# Altium project SYNCBOX_V3I1.PrjPcb (part 5 of 5)

## Sheet [08] - CPU USB.SchDoc
size A2; Organization: Altium Limited; Address1: L3, 12a Rodborough Rd; Address2: Frenchs Forest; Address3: NSW; Address4: Australia 2086; DocumentNumber: 8; SheetNumber: 8; SheetTotal: 11
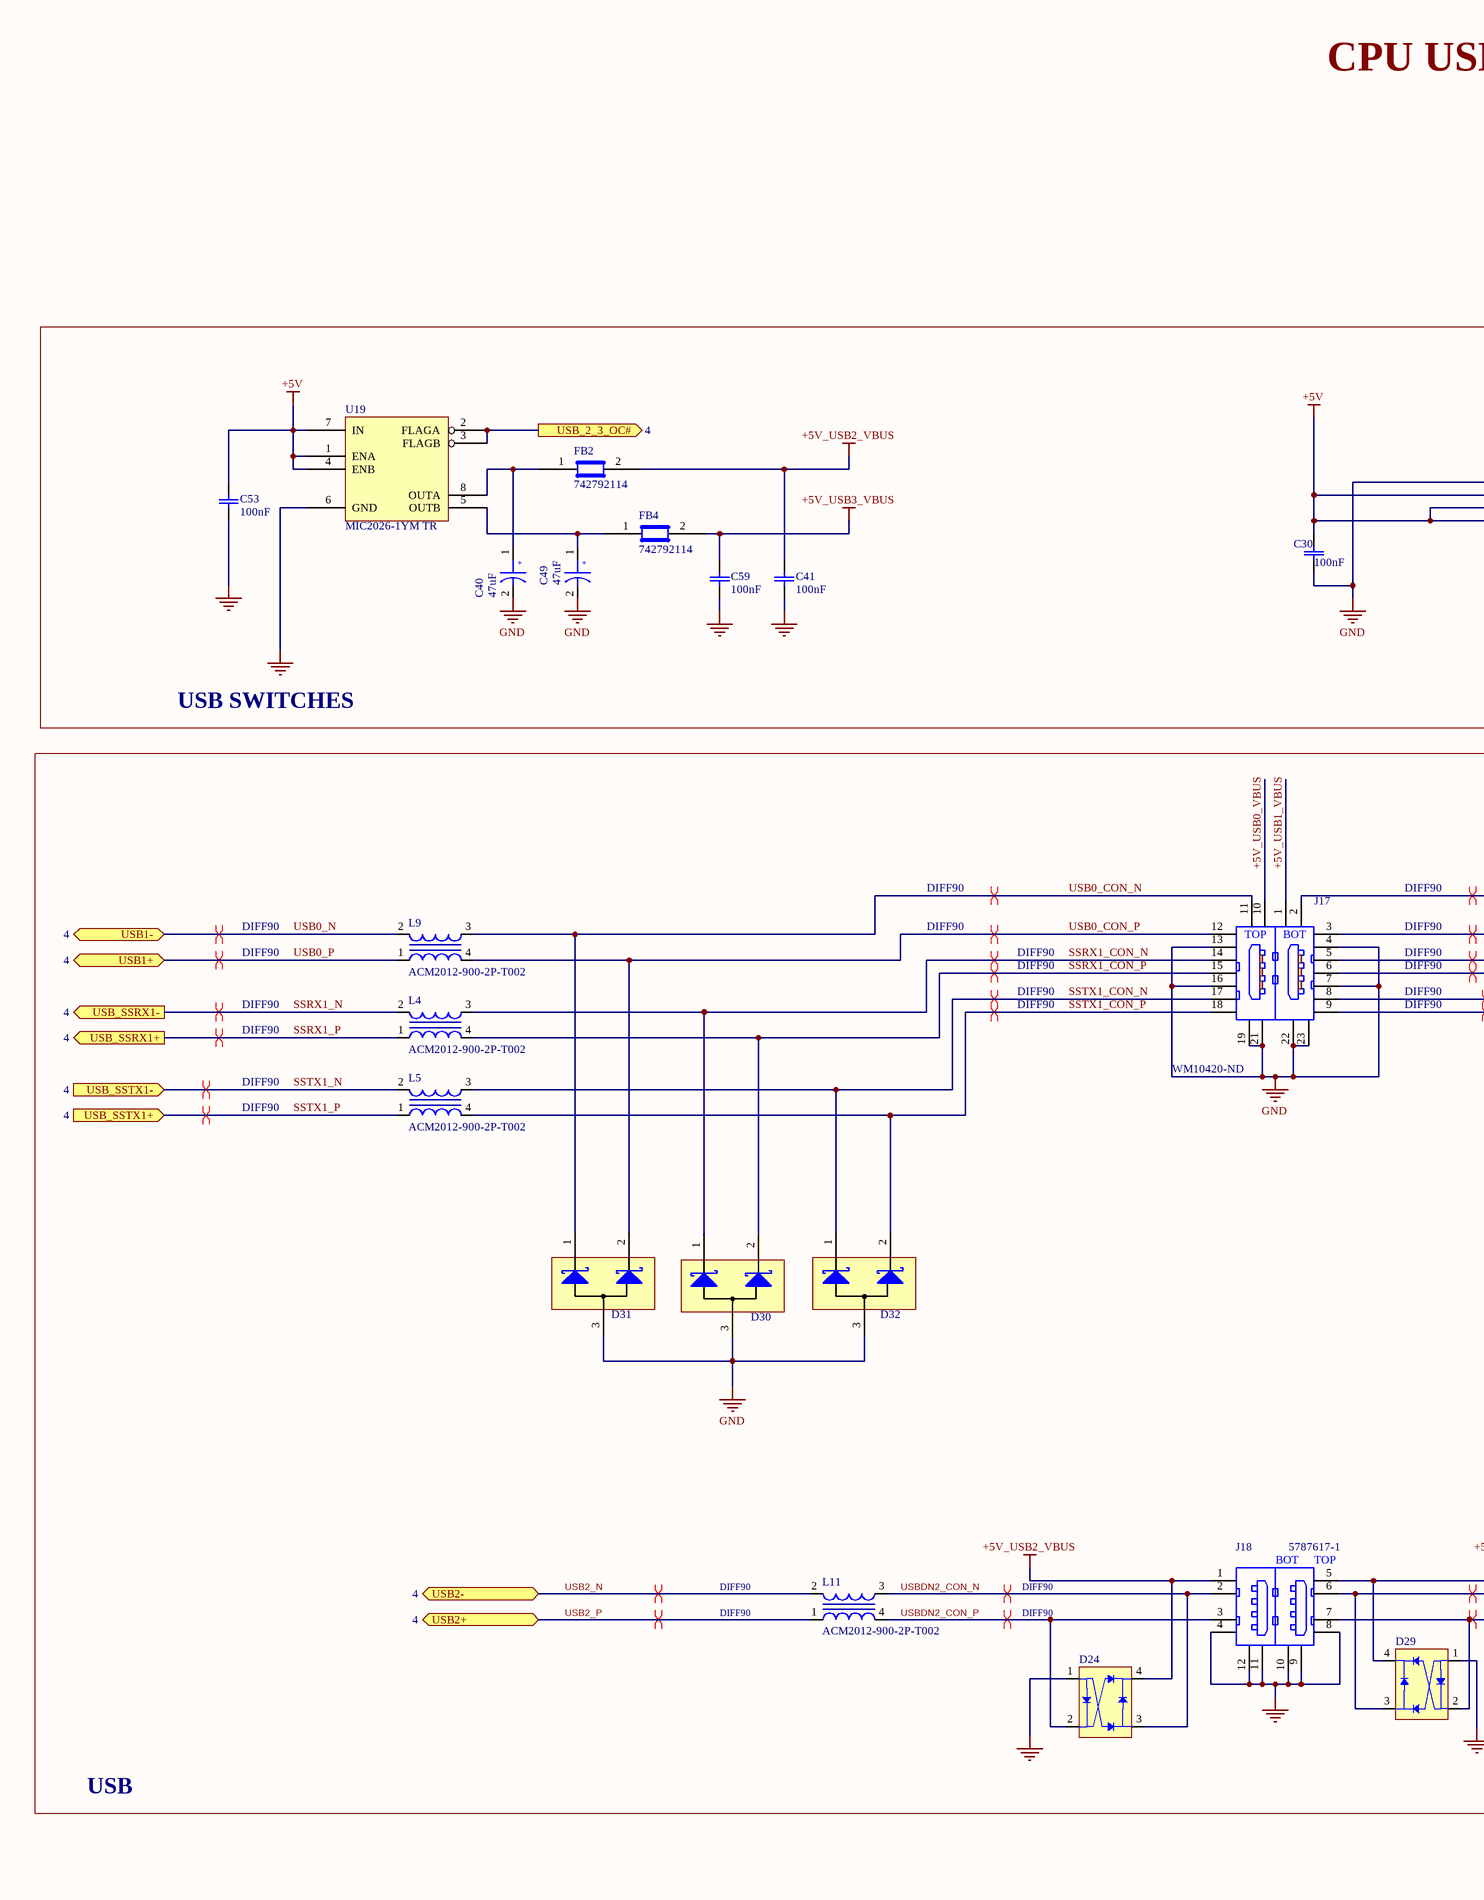
[diagram p12: [08] - CPU USB.SchDoc, left]
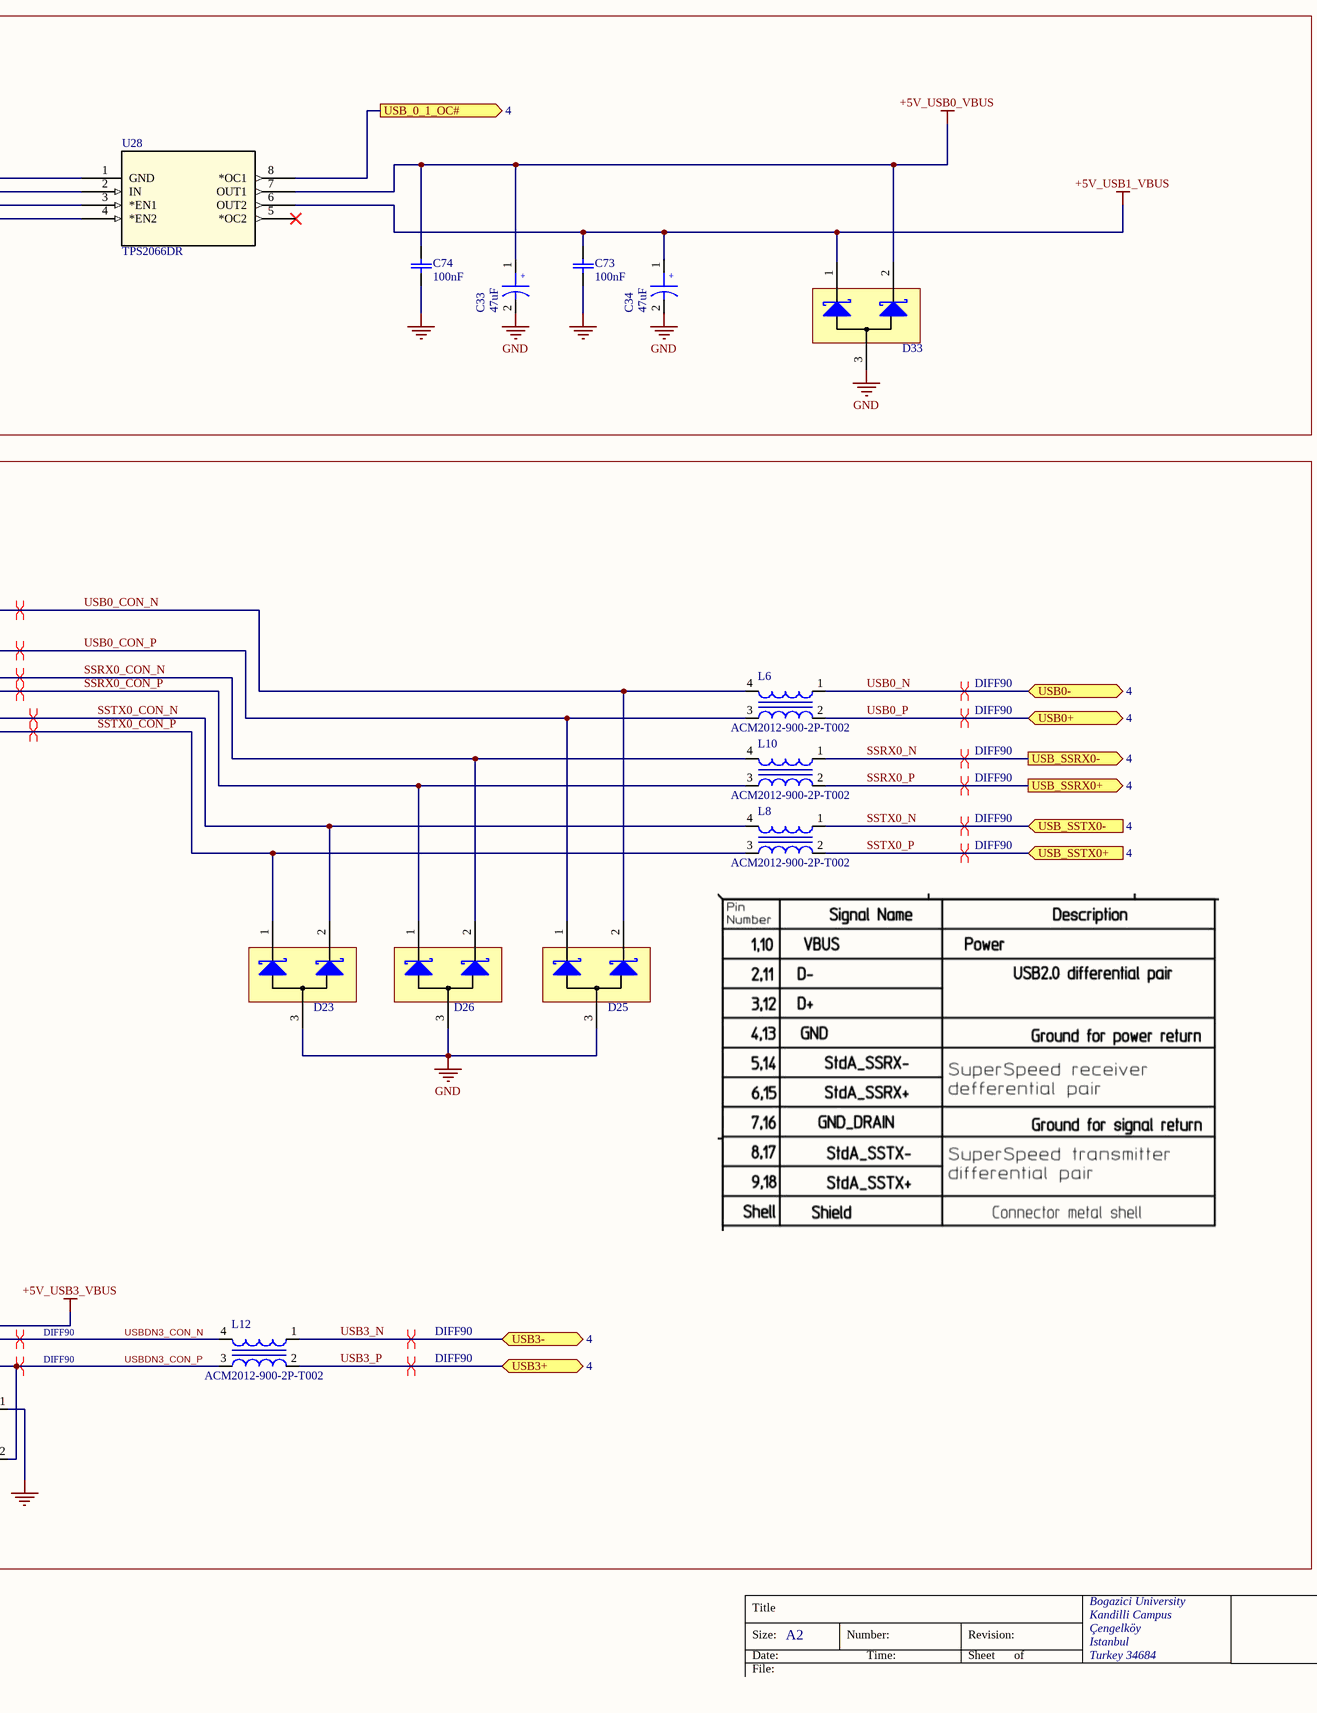
[diagram p13: [08] - CPU USB.SchDoc, right]

### Parts
C30  100nF  [C0402]
C33  47uF  [CAP_P-B]
C34  47uF  [CAP_P-B]
C40  47uF  [CAP_P-B]
C41  100nF  [C0402]
C49  47uF  [CAP_P-B]
C53  100nF  [C0402]
C59  100nF  [C0402]
C73  100nF  [C0402]
C74  100nF  [C0402]
D23  ESD5V3U2U03FH6327XTSA1  [PG-TSLP-3-7]  (value not drawn)
D24  BAS4002ARPPE6327HTSA1  [SOT143B]  (value not drawn)
D25  ESD5V3U2U03FH6327XTSA1  [PG-TSLP-3-7]  (value not drawn)
D26  ESD5V3U2U03FH6327XTSA1  [PG-TSLP-3-7]  (value not drawn)
D29  BAS4002ARPPE6327HTSA1  [SOT143B]  (value not drawn)
D30  ESD5V3U2U03FH6327XTSA1  [PG-TSLP-3-7]  (value not drawn)
D31  ESD5V3U2U03FH6327XTSA1  [PG-TSLP-3-7]  (value not drawn)
D32  ESD5V3U2U03FH6327XTSA1  [PG-TSLP-3-7]  (value not drawn)
D33  ESD5V3U2U03FH6327XTSA1  [PG-TSLP-3-7]  (value not drawn)
FB2  742792114  [Ferrite bead]
FB4  742792114  [Ferrite bead]
J17  WM10420-ND  [USB 3 STACK]
J18  5787617-1  [USB-2A]
L4  ACM2012-900-2P-T002  [ACM2012]
L5  ACM2012-900-2P-T002  [ACM2012]
L6  ACM2012-900-2P-T002  [ACM2012]
L8  ACM2012-900-2P-T002  [ACM2012]
L9  ACM2012-900-2P-T002  [ACM2012]
L10  ACM2012-900-2P-T002  [ACM2012]
L11  ACM2012-900-2P-T002  [ACM2012]
L12  ACM2012-900-2P-T002  [ACM2012]
U19  MIC2026-1YM TR  [8_SOIC_3.9MM]
U28  TPS2066DR  [D8]

### Blocks framed on the sheet
USB SWITCHES: C30 C33 C34 C40 C41 C49 C53 C59 C73 C74 D33 FB2 FB4 U19 U28
USB: D23-D26 D29-D32 J17 J18 L4-L6 L8-L12

### Ports
USB0+ (bidir, see 4), USB0- (bidir, see 4), USB1+ (bidir, see 4), USB1- (bidir, see 4), USB2+ (bidir, see 4), USB2- (bidir, see 4), USB3+ (bidir, see 4), USB3- (bidir, see 4), USB_0_1_OC# (out, see 4), USB_2_3_OC# (out, see 4), USB_SSRX0+ (out, see 4), USB_SSRX0- (out, see 4), USB_SSRX1+ (out, see 4), USB_SSRX1- (out, see 4), USB_SSTX0+ (in, see 4), USB_SSTX0- (in, see 4), USB_SSTX1+ (in, see 4), USB_SSTX1- (in, see 4)

### Nets
+5V: C30.2 C53.2 U19.1(ENA) U19.4(ENB) U19.7(IN) U28.2(IN) U28.3(*EN1) U28.4(*EN2)
+5V_USB0_VBUS: C33.1 C74.2 D33.2 J17.10(VBUS2) U28.7(OUT1)
+5V_USB1_VBUS: C34.1 C73.2 D33.1 J17.1(VBUS1) U28.6(OUT2)
+5V_USB2_VBUS: C41.2 D24.4 FB2.2 J18.1(VBUS)
+5V_USB3_VBUS: C59.2 D29.4 FB4.2 J18.5(VBUS2)
GND: C30.1 C33.2 C34.2 C40.2 C41.1 C49.2 C53.1 C59.1 C73.1 C74.1 D23.3 D24.1 D25.3 D26.3 D29.1 D30.3 D31.3 D32.3 D33.3 J17.4(GND) J17.7(GND_DRAIN1) J17.13(GND) J17.16(GND_DRAIN2) J17.19(SHIELD) J17.21(SHIELD) J17.22(SHIELD) J17.23(SHIELD) J18.4(GND) J18.8(GND) J18.9(SHIELD) J18.10(SHIELD) J18.11(SHIELD) J18.12(SHIELD) U19.6(GND) U28.1(GND)
SSRX0_CON_N: D26.2 J17.5(SSRX0-) L10.4
SSRX0_CON_P: D26.1 J17.6(SSRX0+) L10.3
SSRX0_N: L10.1 ; port USB_SSRX0-
SSRX0_P: L10.2 ; port USB_SSRX0+
SSRX1_CON_N: D30.1 J17.14(SSRX2-) L4.3
SSRX1_CON_P: D30.2 J17.15(SSRX2+) L4.4
SSRX1_N: L4.2 ; port USB_SSRX1-
SSRX1_P: L4.1 ; port USB_SSRX1+
SSTX0_CON_N: D23.2 J17.8(SSTX0-) L8.4
SSTX0_CON_P: D23.1 J17.9(SSTX0+) L8.3
SSTX0_N: L8.1 ; port USB_SSTX0-
SSTX0_P: L8.2 ; port USB_SSTX0+
SSTX1_CON_N: D32.1 J17.17(SSTX2-) L5.3
SSTX1_CON_P: D32.2 J17.18(SSTX2+) L5.4
SSTX1_N: L5.2 ; port USB_SSTX1-
SSTX1_P: L5.1 ; port USB_SSTX1+
USB0_CON_N: D25.2 D31.1 J17.2(D1-) J17.11(D2-) L6.4 L9.3
USB0_CON_P: D25.1 D31.2 J17.3(D1+) J17.12(D2+) L6.3 L9.4
USB0_N: L6.1 L9.2 ; port USB0-, port USB1-
USB0_P: L6.2 L9.1 ; port USB0+, port USB1+
USB2_N: L11.2 ; port USB2-
USB2_P: L11.1 ; port USB2+
USB3_N: L12.1 ; port USB3-
USB3_P: L12.2 ; port USB3+
USBDN2_CON_N: D24.3 J18.2(D-) L11.3
USBDN2_CON_P: D24.2 J18.3(D+) L11.4
USBDN3_CON_N: D29.3 J18.6(D2-) L12.4
USBDN3_CON_P: D29.2 J18.7(D2+) L12.3
NetC40_1: C40.1 FB2.1 U19.8(OUTA)
NetC49_1: C49.1 FB4.1 U19.5(OUTB)
NetJ8#1_A44: U19.2(FLAGA) U19.3(FLAGB) ; port USB_2_3_OC#
NetJ8#1_B44: U28.8(*OC1) ; port USB_0_1_OC#

Not connected (* = marked no-connect by the designer): U28 5(*OC2)*

### Layout directives
differential pair; net class DIFF90; net class USB0: USBDN2_CON_N, USBDN2_CON_P, USBDN3_CON_N, USBDN3_CON_P
differential pair; net class DIFF90: SSRX0_CON_N, SSRX0_CON_P, SSRX0_N, SSRX0_P, SSRX1_CON_N, SSRX1_CON_P, SSRX1_N, SSRX1_P, SSTX0_CON_N, SSTX0_CON_P, SSTX0_N, SSTX0_P, SSTX1_CON_N, SSTX1_CON_P, SSTX1_N, SSTX1_P, USB0_CON_N, USB0_CON_P, USB0_N, USB0_P, USB2_N, USB2_P, USB3_N, USB3_P

### Notes on the sheet
- CPU USB
- Title
- Bogazici University
- Size:
- Date:
- File:
- A2
- Number:
- Time:
- Revision:
- Sheet
- of
- Kandilli Campus
- Çengelköy
- Istanbul
- Turkey 34684
- (in symbol 5787617-1) BOT; TOP
- (in symbol PCG1C470MCL1GS) +
- (in symbol USB 3) TOP; BOT

### Library data of the parts
C30 C41 C53 C59 C73 C74 = CL05A104KA5NNNC: CAP CER 0.1UF 50V X8R 0603; Manufacturer 1: Samsung Electro-Mechanics; Voltage - Rated: 25V; Tolerance: ±10%; Temperature Coefficient: X5R; Notification: Current market demand for these product types have resulted in fluctuating and extending lead times. Lead times may differ.; Description 1: CAP CER 0.1UF 25V X5R 0402; Category: Capacitors; Operating Temperature: -55°C ~ 85°C; Package / Case: 0402 (1005 Metric); Supplier 1: Digi-Key; Supplier Part Number 1: 1276-1043-6-ND; RoHS: RoHS Compliant; Stock 1: 100000; Pricing 1: 1=0.1, 10=0.04, 100=0.0176, 500=0.0126, 1000=0.0099, 2500=0.009, 5000=0.00828 (USD); Mounting Type: Surface Mount, MLCC; Applications: General Purpose; Ratings: -; Size / Dimension: 0.039" L x 0.020" W (1.00mm x 0.50mm); Height - Seated (Max): -; Thickness (Max): 0.022" (0.55mm); Lead Spacing: -; Features: -; Packaging: Digi-Reel®; Lead Style: -; ComponentLink1URL: http://www.samsungsem.com/kr/support/product-search/mlcc/CL05A104KA5NNNC.jsp; ComponentLink1Description: http://www.samsungsem.com/kr/support/product-search/mlcc/CL05A104KA5NNNC.jsp; Manufacturer Part Number 1: CL05A104KA5NNNC; Part Status: Active
C33 C34 C40 C49 = PCG1C470MCL1GS: CAP ALUM POLY 47UF 20% 16V SMD; Manufacturer 1: Nichicon; Type: Polymer; ESR (Equivalent Series Resistance): 40 mOhm; Lifetime @ Temp.: 2000 Hrs @ 105°C; Surface Mount Land Size: 0.209" L x 0.209" W (5.30mm x 5.30mm); .Checked PCB: CHK; Manufacturer Part Number 1: PCG1C470MCL1GS; RoHS: RoHS Compliant; Stock 1: 4045; Pricing 1: 1=1.42, 10=1.123, 100=0.8422, 500=0.63636 (USD); Packaging: Digi-Reel®; Part Status: Active; Tolerance: ±20%; Operating Temperature: -55°C ~ 105°C; Ratings: -; Applications: General Purpose; Lead Spacing: -; Size / Dimension: 0.197" Dia (5.00mm); Height - Seated (Max): 0.236" (6.00mm); Mounting Type: Surface Mount; Package / Case: Radial, Can - SMD; ComponentLink1URL: http://nichicon-us.com/english/products/pdfs/e-pcg.pdf; ComponentLink1Description: http://nichicon-us.com/english/products/pdfs/e-pcg.pdf; Supplier 1: Digi-Key; Supplier Part Number 1: 493-3095-6-ND; Description 1: CAP ALUM POLY 47UF 20% 16V SMD; Category: Capacitors; .Checked SCH: CHK
D23 D25 D26 D30-D33 = ESD5V3U2U03FH6327XTSA1: TVS DIODE 5.3V 15V TSFP-3; Manufacturer 1: Infineon Technologies; Type: Zener; Voltage - Reverse Standoff (Typ): 5.3V (Max); Voltage - Breakdown (Min): 6V; Current - Peak Pulse (10/1000µs): 3A (8/20µs); Power Line Protection: No; Capacitance @ Frequency: 0.4pF @ 1MHz; .Checked PCB: CHK; Manufacturer Part Number 1: ESD5V3U2U03FH6327XTSA1; RoHS: RoHS Compliant; Stock 1: 21994; Pricing 1: 1=0.38, 10=0.311, 100=0.2118, 500=0.15886, 1000=0.11915 (USD); Packaging: Cut Tape (CT); Part Status: Active; Voltage - Clamping (Max) @ Ipp: 15V; Power - Peak Pulse: -; Applications: General Purpose; Operating Temperature: -40°C ~ 125°C (TJ); Mounting Type: Surface Mount; Package / Case: SOT-723; Supplier Device Package: PG-TSFP-3; Base Part Number: ESD5V3; ComponentLink1URL: https://www.infineon.com/dgdl/esd5v3u2useries.pdf?folderId=db3a30431441fb5d011488a9e66f0ded&fileId=db3a30431b0626df011b0d3e3ca97dc0; ComponentLink1Description: https://www.infineon.com/dgdl/esd5v3u2useries.pdf?folderId=db3a30431441fb5d011488a9e66f0ded&fileId=db3a30431b0626df011b0d3e3ca97dc0; Supplier 1: Digi-Key; Supplier Part Number 1: ESD5V3U2U03FH6327XTSA1CT-ND; Description 1: TVS DIODE 5.3V 15V TSFP-3; Category: Circuit Protection; .Checked SCH: CHK
D24 D29 = BAS4002ARPPE6327HTSA1: DIODE BRIDGE 40V 200MA SOT 143; Manufacturer 1: Infineon Technologies; Diode Type: Single Phase; Manufacturer Part Number 1: BAS4002ARPPE6327HTSA1; RoHS: RoHS Compliant; Stock 1: 44305; Pricing 1: 1=0.47, 10=0.406, 100=0.3031, 500=0.23816, 1000=0.18403 (USD); Packaging: Digi-Reel®; Part Status: Active; Technology: Standard; Operating Temperature: 150°C (TJ); Mounting Type: Surface Mount; Package / Case: TO-253-4, TO-253AA; Supplier Device Package: PG-SOT143-4; Base Part Number: BAS4002; ComponentLink1URL: https://www.infineon.com/dgdl/bas4002aseries.pdf?folderId=db3a30431f848401011fcbf2ab4c04c4&fileId=db3a304329a0f6ee0129a6dc9f802b68; ComponentLink1Description: https://www.infineon.com/dgdl/bas4002aseries.pdf?folderId=db3a30431f848401011fcbf2ab4c04c4&fileId=db3a304329a0f6ee0129a6dc9f802b68; Supplier 1: Digi-Key; Supplier Part Number 1: BAS4002ARPPE6327HTSA1DKR-ND; Description 1: DIODE BRIDGE 40V 200MA SOT 143; Category: Discrete Semiconductor Products
FB2 FB4 = FB742792114: FERRITE BEAD 50 OHM 1206 1LN; Filter Type: Signal Line; Current Rating (Max): 3A; DC Resistance (DCR) (Max): 25 mOhm; .Checked PCB: CHK; Supplier 1: Digi-Key; Supplier Part Number 1: 732-1621-6-ND; Manufacturer 2: Wurth Electronics Inc.; Manufacturer Part Number 2: 742792114; RoHS: RoHS Compliant; Stock 2: 21934; Pricing 2: 1=0.24, 10=0.238, 50=0.219, 100=0.209, 500=0.2, 1000=0.19 (USD); Packaging: Cut Tape (CT); Part Status: Active; Ratings: -; Operating Temperature: -55°C ~ 125°C; Package / Case: 1206 (3216 Metric); Mounting Type: Surface Mount; Height (Max): 0.051" (1.30mm); Size / Dimension: 0.126" L x 0.063" W (3.20mm x 1.60mm); ComponentLink1URL: http://katalog.we-online.de/pbs/datasheet/742792114.pdf; ComponentLink1Description: http://katalog.we-online.de/pbs/datasheet/742792114.pdf; Supplier 2: Digi-Key; Supplier Part Number 2: 732-1621-1-ND; Description 2: FERRITE BEAD 50 OHM 1206 1LN; Category: Filters; .Checked SCH: CHK
J17 = USB 3: USB 3.0 RA DUAL REC TH TYPE A; Manufacturer 1: Molex, LLC; Manufacturer Part Number 1: 0484060003; Connector Type: USB - A, Stacked; Number of Contacts: 18; Gender: Receptacle; Specifications: USB 3.0 (USB 3.1 Gen 1, Superspeed); Current Rating: 0.25A, 1.8A; Voltage - Rated: 30VAC/DC; Mating Cycles: 5000; Shielding: Shielded; Material Flammability Rating: UL94 HB; .Checked PCB: CHK; RoHS: RoHS Compliant; Stock 1: 11990; Pricing 1: 1=2.23, 10=2.026, 25=1.902, 50=1.8194, 100=1.7367, 250=1.57132, 500=1.44726, 1000=1.2405, 2500=1.1578 (USD); Packaging: Tray; Part Status: Active; Mounting Type: Through Hole, Right Angle; Mounting Feature: Horizontal; Termination: Solder; Features: Board Lock; Ingress Protection: -; Operating Temperature: -20°C ~ 85°C; Contact Finish: Gold; Shell/Shielding Material: Steel, Stainless; Insulation Color: Blue; ComponentLink1URL: https://www.molex.com/pdm_docs/sd/484060003_sd.pdf; ComponentLink1Description: https://www.molex.com/pdm_docs/sd/484060003_sd.pdf; Description 1: USB 3.0 RA DUAL REC TH TYPE A; Category: Connectors, Interconnects; Supplier 1: Digi-Key; Supplier Part Number 1: WM10420-ND; .Checked SCH: CHK
J18 = 5787617-1: CONN RCPT R/A 4OVER4POS GOLD PCB; Manufacturer: TE Connectivity; .Checked PCB: CHK; Connector Type: USB - A, Stacked; Number of Contacts: 8; Gender: Receptacle; Specifications: USB 2.0; .Checked SCH: CHK; Category: Connectors, Interconnects; Family: USB, IEEE-1394 (Firewire), DVI, HDMI; Manufacturer Part Number: 5787617-1; Price 1k [$]: 1.68753; Supplier: Digikey; Supplier Part Number: A31728-ND; Value: 5787617-1; Supplier 1: Digi-Key; Supplier Part Number 1: A31728-ND; RoHS: RoHS Compliant; Stock 1: 5401; Pricing 1: 1=3.33, 10=3.197, 25=2.9308, 50=2.7978, 100=2.6645, 250=2.33144, 500=2.26484, 1000=1.93178, 2500=1.79855 (USD); Mounting Type: Through Hole, Right Angle, Horizontal; Features: Board Lock; Packaging: Tray; Ingress Protection: -; ComponentLink1URL: http://documents.tycoelectronics.com/commerce/DocumentDelivery/DDEController?Action=srchrtrv&DocNm=5787617&DocType=CD&DocLang=EN; ComponentLink1Description: http://documents.tycoelectronics.com/commerce/DocumentDelivery/DDEController?Action=srchrtrv&DocNm=5787617&DocType=CD&DocLang=EN
L4-L6 L8-L12 = ACM2012-900-2P-T002: CHOKE COMM MODE 90 OHM .4A SMD; Manufacturer: TDK Corporation; Filter Type: Data, Signal Line; Number of Lines: 2; Current: 400mA; DC Resistance (DCR): 190 mOhm Max; Impedance: 90 Ohm; Resistance (Ohms): 8.2K; Power (Watts): 0.063W, 1/16W; Temperature Coefficient: ±100ppm/°C; Tolerance: ±1%; .Checked PCB: CHK; Supplier 1: Digi-Key; Supplier Part Number 1: 445-2207-1-ND; Manufacturer Part Number: ACM2012-900-2P-T002; RoHS: RoHS Compliant; Category: Filters; Stock 1: 175768; Pricing 1: 1=0.48, 10=0.448, 50=0.42, 100=0.364, 500=0.308, 1000=0.252 (USD); Inductance: -; Mounting Type: Surface Mount; Size / Dimension: 0.079" L x 0.047" W (2.00mm x 1.20mm); Height (Max): 0.051" (1.30mm); Package / Case: 0805 (2012 Metric), 4 Lead; Operating Temperature: -25°C ~ 85°C; Packaging: Cut Tape (CT); ComponentLink1URL: http://www.tdk.co.jp/tefe02/e9719_acm2012.pdf; ComponentLink1Description: http://www.tdk.co.jp/tefe02/e9719_acm2012.pdf; Composition: Thick Film; Features: -; Height: 0.016" (0.40mm); Number of Terminations: 2; ComponentLink2URL: http://www.yageo.com/documents/recent/PYu-RC0402_51_RoHS_L_6.pdf; ComponentLink2Description: http://www.yageo.com/documents/recent/PYu-RC0402_51_RoHS_L_6.pdf; .Checked SCH: CHK
U19 = MIC2026-1YM TR: IC SW DISTRIBUTION 2CHAN 8SOIC; Manufacturer: Micrel Inc; .Checked PCB: CHK; Number of Outputs: 2; Rds (On): 140 mOhm; Internal Switch(s): Yes; Current Limit: 900mA; Voltage - Input: 2.7 V ~ 5.5 V; .Checked SCH: CHK; Category: Integrated Circuits (ICs); Family: PMIC - Power Distribution Switches; Manufacturer Part Number: MIC2026-1YM TR; Operating Temperature: -40°C ~ 85°C; Package / Case: 8-SOIC (0.154", 3.90mm Width); Price 1k [$]: 0.53200; Supplier: Digikey; Supplier Part Number: 576-1059-1-ND; Value: MIC2026-1YM TR; Supplier 1: Digi-Key; Supplier Part Number 1: 576-1059-1-ND; RoHS: RoHS Compliant; Stock 1: 44857; Pricing 1: 1=1.14, 25=0.95, 100=0.76, 250=0.57, 500=0.532 (USD); Type: High Side Switch; Mounting Type: Surface Mount; Supplier Device Package: 8-SOIC; Packaging: Cut Tape (CT); ComponentLink1URL: http://www.micrel.com/_PDF/mic2026.pdf; ComponentLink1Description: http://www.micrel.com/_PDF/mic2026.pdf
U28 = TPS2066DR: IC PWR DIST SW DUAL 8SOIC; Vendor: Texas Instruments; Built_By: EMA_UL_Team; C: Copyright (C) 2015 Accelerated Designs. All rights reserved; Switch Type: General Purpose; Number of Outputs: 2; Ratio - Input:Output: 1:2; Output Configuration: High Side; Output Type: N-Channel; Interface: On/Off; Voltage - Load: 2.7 V ~ 5.5 V; Voltage - Supply (Vcc/Vdd): Not Required; Current - Output (Max): 1A; Rds On (Typ): 70 mOhm; Input Type: Non-Inverting; Fault Protection: Current Limiting (Fixed), Over Temperature, UVLO; Manufacturer_Part_Number: TPS2066DR; Manufacturer: Texas Instruments; RefDes: RefDes; Type: DEV; Value: Value; Manufacturer 1: Texas Instruments; Manufacturer Part Number 1: TPS2066DR; RoHS: RoHS Compliant; Stock 1: 12576; Pricing 1: 1=1.87, 10=1.681, 100=1.3514, 500=1.11034, 1000=0.92 (USD); Packaging: Digi-Reel®; Part Status: Active; Features: Status Flag; Operating Temperature: -40°C ~ 125°C (TJ); Package / Case: 8-SOIC (0.154", 3.90mm Width); Supplier Device Package: 8-SOIC; Base Part Number: TPS2066; ComponentLink1URL: http://www.ti.com/lit/ds/symlink/tps2061.pdf; ComponentLink1Description: http://www.ti.com/lit/ds/symlink/tps2061.pdf; Supplier 1: Digi-Key; Supplier Part Number 1: 296-28004-6-ND; Description 1: IC PWR DIST SW DUAL 8SOIC; Category: Integrated Circuits (ICs)

## Sheet [09] - PCB AND MECHANICALS.SchDoc
size A2; Organization: Altium Limited; Address1: L3, 12a Rodborough Rd; Address2: Frenchs Forest; Address3: NSW; Address4: Australia 2086; DocumentNumber: 9; SheetNumber: 9; SheetTotal: 11
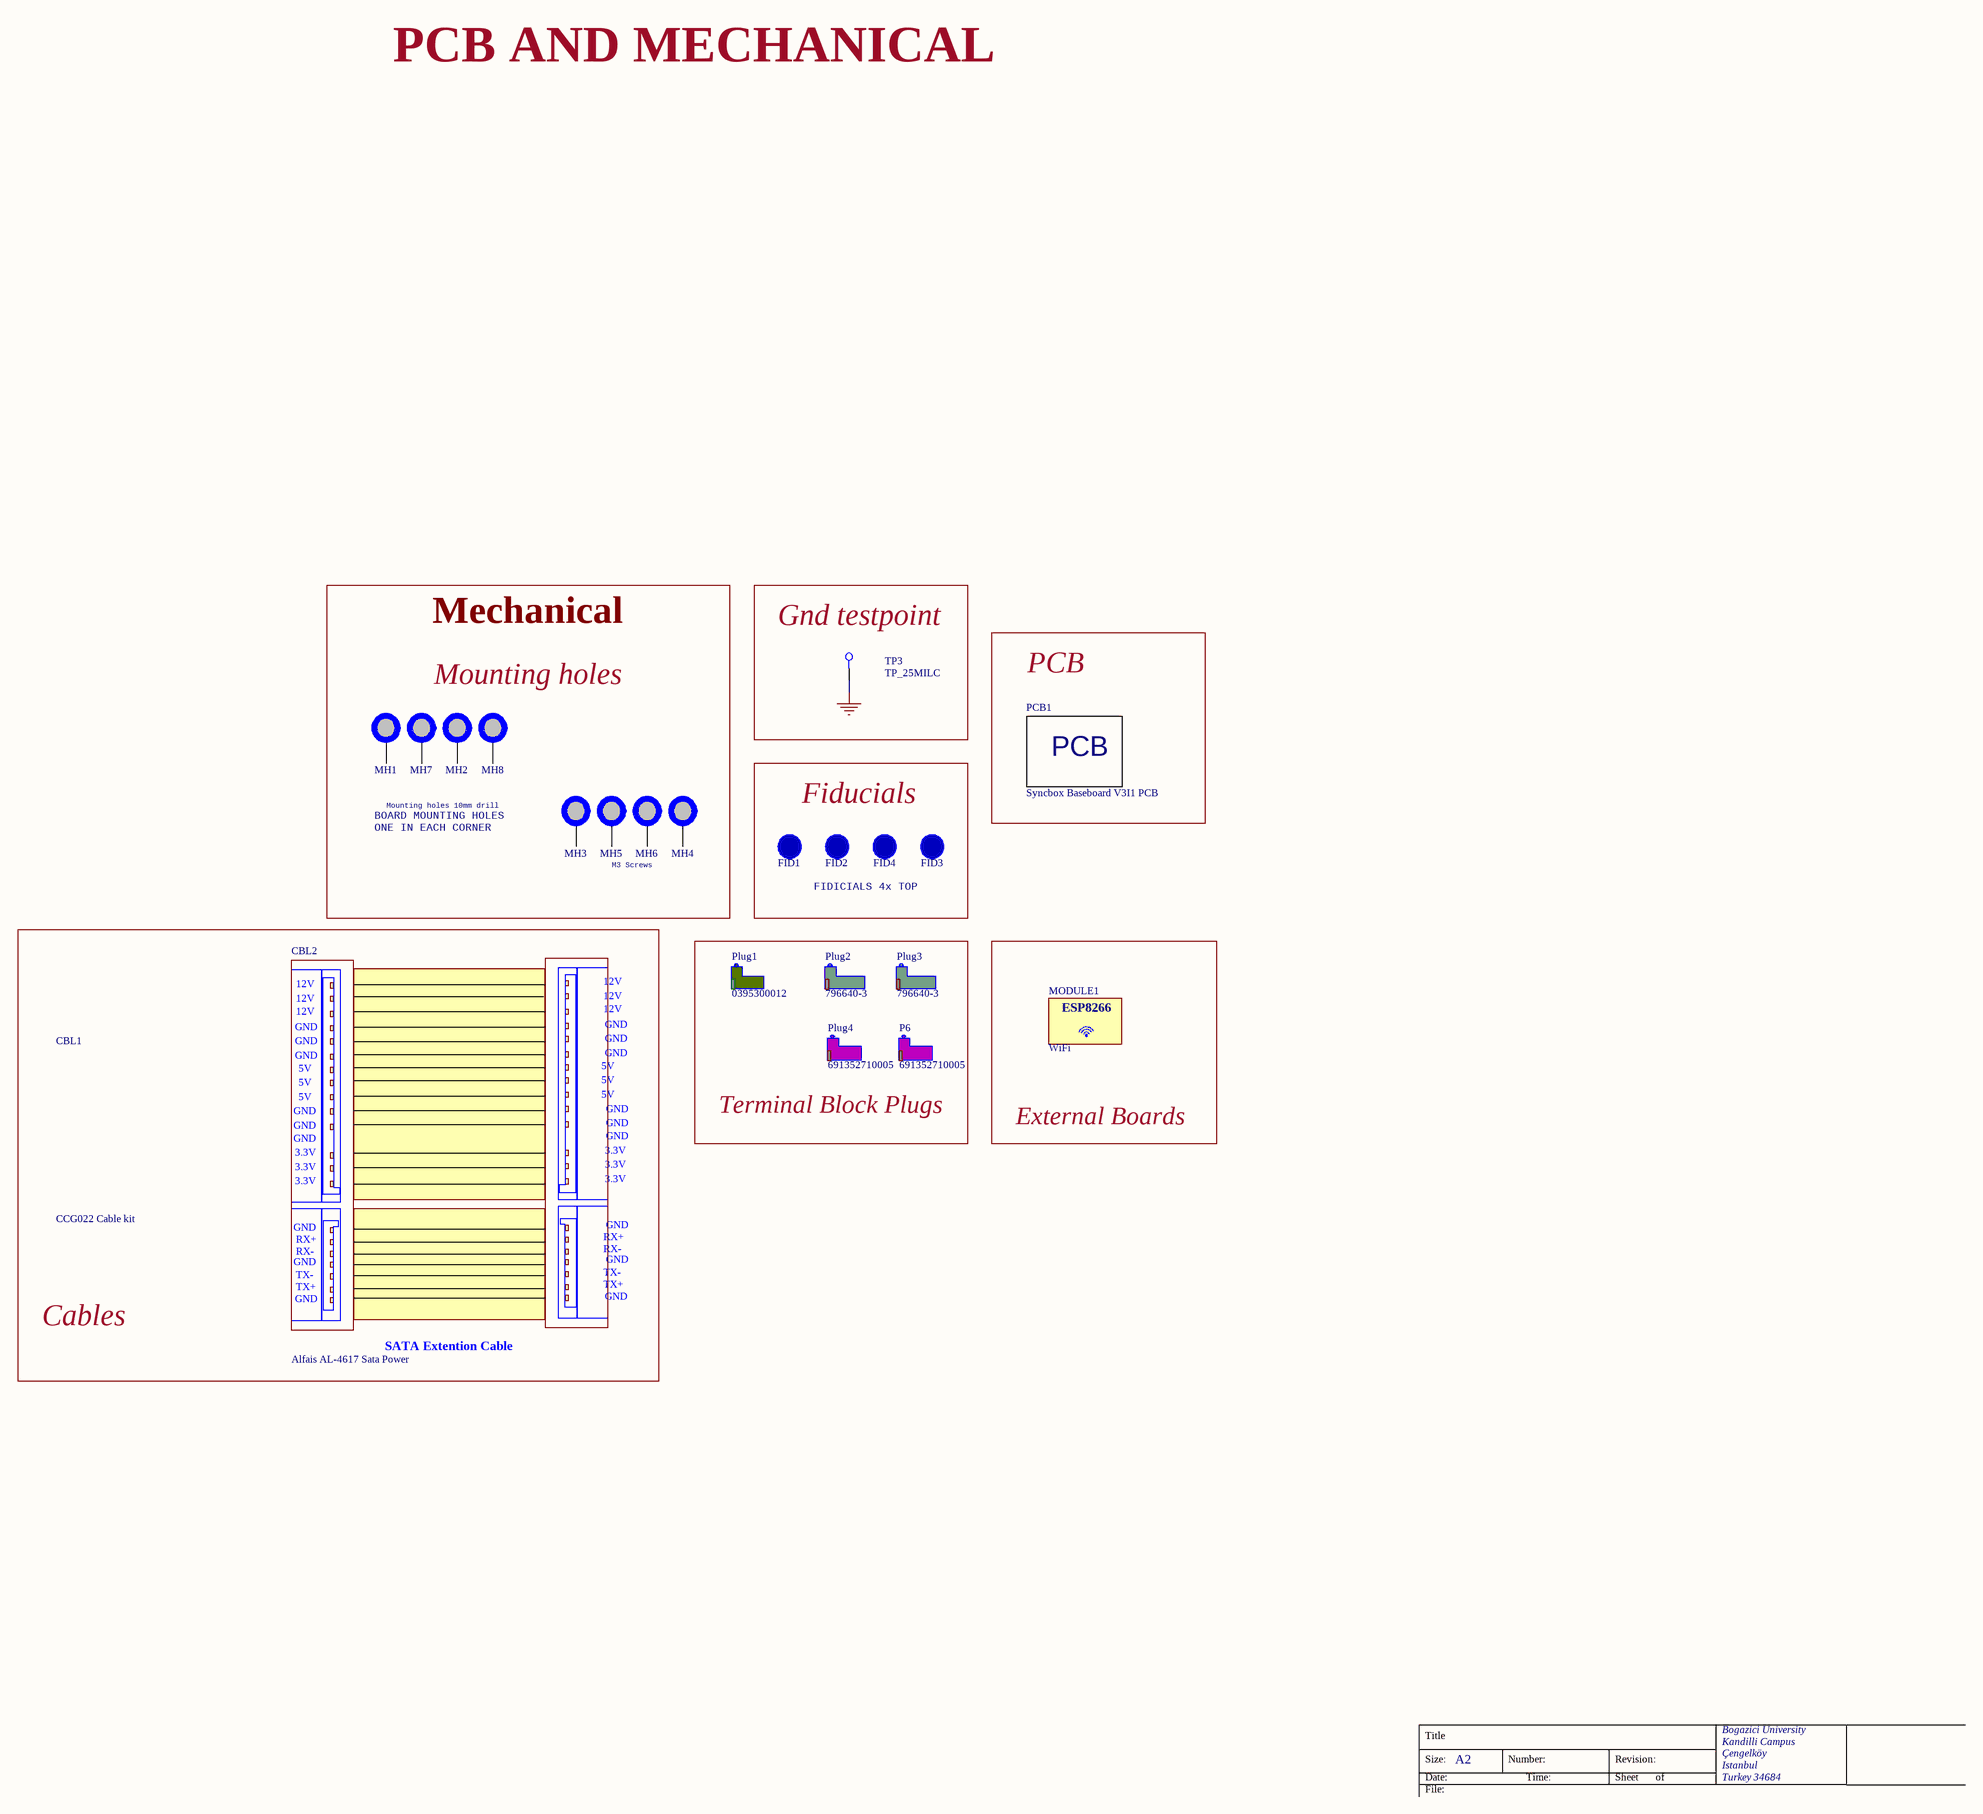
[diagram p14: [09] - PCB AND MECHANICALS.SchDoc]

### Parts
CBL1  CCG022 Cable kit
CBL2  Alfais AL-4617 Sata Power
FID1  FID_1MMC  [FID_40X120D]  (value not drawn)  (no BOM)
FID2  FID_1MMC  [FID_40X120D]  (value not drawn)  (no BOM)
FID3  FID_1MMC  [FID_40X120D]  (value not drawn)  (no BOM)
FID4  FID_1MMC  [FID_40X120D]  (value not drawn)  (no BOM)
MH1  MH_12MMC_10MMD  [MH_12MMC_10MMD]  (value not drawn)  (no BOM)
MH2  MH_12MMC_10MMD  [MH_12MMC_10MMD]  (value not drawn)  (no BOM)
MH3  MH_7MMC_3.2MMD  [MH_7MMC_3.2MMD]  (value not drawn)  (no BOM)
MH4  MH_7MMC_3.2MMD  [MH_7MMC_3.2MMD]  (value not drawn)  (no BOM)
MH5  MH_7MMC_3.2MMD  [MH_7MMC_3.2MMD]  (value not drawn)  (no BOM)
MH6  MH_7MMC_3.2MMD  [MH_7MMC_3.2MMD]  (value not drawn)  (no BOM)
MH7  MH_12MMC_10MMD  [MH_12MMC_10MMD]  (value not drawn)  (no BOM)
MH8  MH_12MMC_10MMD  [MH_12MMC_10MMD]  (value not drawn)  (no BOM)
MODULE1  WiFi
P6  691352710005
PCB1  Syncbox Baseboard V3I1 PCB  (mechanical)
Plug1  0395300012
Plug2  796640-3
Plug3  796640-3
Plug4  691352710005
TP3  TP_25MILC  [TP_25C]  (no BOM)

### Blocks framed on the sheet
Mechanical: MH1-MH8
Gnd testpoint: TP3
PCB: PCB1
Fiducials: FID1-FID4
Cables: CBL1 CBL2
Terminal Block Plugs: P6 Plug1-Plug4
External Boards: MODULE1

### Nets
GND: TP3.1

Not connected (* = marked no-connect by the designer): MH1 1; MH2 1; MH3 1; MH4 1; MH5 1; MH6 1; MH7 1; MH8 1

### Notes on the sheet
- PCB AND MECHANICAL
- Mounting holes
- BOARD MOUNTING HOLES
- Mounting holes 10mm drill
- ONE IN EACH CORNER
- M3 Screws
- FIDICIALS 4x TOP
- Title
- Bogazici University
- Size:
- Date:
- File:
- A2
- Number:
- Time:
- Revision:
- Sheet
- of
- Kandilli Campus
- Çengelköy
- Istanbul
- Turkey 34684
- (in symbol PCB_iMX6_REX_Baseboard_V1I1) PCB
- (in symbol Sata Cable) 12V; GND; 5V; 3.3V; RX+; RX-; TX-; TX+; SATA Extention Cable

### Library data of the parts
CBL1 = CCG022 Cable kit: Manufacturer 1: Connect Tech Inc.; Description 1: CCG022 Cable kit
CBL2 = Sata Cable: Link: https://www.hepsiburada.com/alfais-al-4617-sata-power-uzatma-kablosu-15-7-pin-erkek-disi-p-HBV0000036H5X?magaza=Evaletim&wt_gl=cpc.elk.bilgisayar-diger.pla&gclid=CjwKCAjwqarbBRBtEiwArlfEIASQuXBo12kuMcANrOEiBIck8mIu7ZL_Q8g_5a_TDIHKOnPRLHuDrhoCfg0QAvD_BwE; Manufacturer 1: Alfais; Description 1: Alfais AL-4617 Sata Power
FID1-FID4 = FID_1MMC: Fiducial 40mil Diameter, 120mil Mask; .Checked PCB: CHK; Supplier: Digikey; .Checked SCH: CHK
MH1 MH2 MH7 MH8 = MH_12MMC_10MMD: Mounting Hole 12mm Diameter, 10mm Drill
MH3-MH6 = MH_7MMC_3.2MMD: Mounting Hole 7mm Diameter, 3.2mm Drill
MODULE1 = ESP8266 WiFi Module: TXRX ESP8266 MOD WIFI TRACE ANT; Manufacturer 1: Seeed Technology Co., Ltd; Manufacturer Part Number 1: 317060016; Protocol: 802.11b/g/n; Frequency: 2.4GHz ~ 2.48GHz; Data Rate: 72.2Mbps; Power - Output: 15dBm; Sensitivity: -98dBm; Serial Interfaces: UART; Antenna Type: Integrated, Trace; Memory Size: 1MB Flash; Voltage - Supply: 3.3V; Current - Receiving: 62mA; Current - Transmitting: 215mA; RoHS: RoHS Compliant; Stock 1: 326; Pricing 1: 1=7.09 (USD); Packaging: Bulk; Part Status: Active; RF Family/Standard: WiFi; Modulation: -; Utilized IC / Part: ESP8266; Mounting Type: Through Hole; Operating Temperature: -20°C ~ 100°C; Package / Case: Module; ComponentLink1URL: https://media.digikey.com/pdf/Data%20Sheets/Seeed%20Technology/317060016_Web.pdf; ComponentLink1Description: https://media.digikey.com/pdf/Data%20Sheets/Seeed%20Technology/317060016_Web.pdf; Supplier 1: Digi-Key; Supplier Part Number 1: 1597-1145-ND; Description 1: TXRX ESP8266 MOD WIFI TRACE ANT; Category: RF/IF and RFID
P6 Plug4 = 691352710005: TERM BLOCK PLUG 5POS STR 5MM; Manufacturer 1: Wurth Electronics Inc.; Number of Positions: 5; Number of Levels: 1; Pitch: 0.197" (5.00mm); Plug Wire Entry: 180°; Wire Gauge or Range - AWG: 12-24 AWG; Wire Gauge or Range - mm²: 0.2-3mm²; Material Flammability Rating: UL94 V-0; Screw Size: M3; Torque - Screw: 0.56 Nm (5.0 Lb-In); Wire Strip Length: 7-8mm; Manufacturer Part Number 1: 691352710005; RoHS: RoHS Compliant; Stock 1: 164; Pricing 1: 1=3.02, 10=2.706, 50=2.337, 150=2.091, 300=1.968 (USD); Packaging: Bulk; Part Status: Active; Type: Plug, Female Sockets; Positions Per Level: 5; Header Orientation: -; Termination Style: Screw - Leaf Spring, Wire Guard; Mounting Type: Free Hanging (In-Line); Current - IEC: -; Color: Green; Operating Temperature: -40°C ~ 105°C; Contact Mating Finish: -; Features: Retention Latches (Non-Wire Side); Ingress Protection: -; Contact Material: -; Housing Material: Polyamide (PA66), Nylon 6/6; Contact Tail Length: -; Insulation Height: 0.594" (15.09mm); ComponentLink1URL: http://katalog.we-online.de/em/datasheet/6913527100xx.pdf; ComponentLink1Description: http://katalog.we-online.de/em/datasheet/6913527100xx.pdf; Supplier 1: Digi-Key; Supplier Part Number 1: 732-2778-ND; Description 1: TERM BLOCK PLUG 5POS STR 5MM; Category: Connectors, Interconnects
PCB1 = PCB_iMX6_REX_Baseboard_V1I1: Printed Circuit Board; .Creator: MM; Category: Printed circuits board
Plug1 = 0395300012: TERM BLOCK PLUG 12POS STR 5.08MM; Manufacturer 1: Molex, LLC; Number of Positions: 12; Number of Levels: 1; Pitch: 0.200" (5.08mm); Plug Wire Entry: 180°; Wire Gauge or Range - AWG: 12-26 AWG; Screw Size: M3; Torque - Screw: 0.56 Nm (5.0 Lb-In); Wire Strip Length: 5mm; Manufacturer Part Number 1: 0395300012; RoHS: RoHS Compliant; Stock 1: 734; Pricing 1: 1=6.65, 10=5.245, 25=4.9892, 50=4.5286, 100=4.3494, 250=3.83772, 500=3.58188, 1000=3.32602 (USD); Packaging: Bulk; Part Status: Active; Type: Plug, Female Sockets; Positions Per Level: 12; Header Orientation: -; Termination Style: Screw - Rising Cage Clamp; Mounting Type: Free Hanging (In-Line); Current - IEC: -; Wire Gauge or Range - mm²: -; Color: Black; Operating Temperature: -40°C ~ 115°C; Contact Mating Finish: Tin; Features: Retention Latches (Non-Wire Side); Material Flammability Rating: -; Ingress Protection: -; Contact Material: Copper Alloy; Housing Material: Polyamide (PA), Nylon; Contact Tail Length: -; Insulation Height: 0.591" (15.00mm); ComponentLink1URL: https://www.molex.com/pdm_docs/sd/395300002_sd.pdf; ComponentLink1Description: https://www.molex.com/pdm_docs/sd/395300002_sd.pdf; Supplier 1: Digi-Key; Supplier Part Number 1: WM7825-ND; Description 1: TERM BLOCK PLUG 12POS STR 5.08MM; Category: Connectors, Interconnects
Plug2 Plug3 = 796640-3: TERM BLOCK PLUG 3POS STR 5MM; Manufacturer 1: TE Connectivity AMP Connectors; Number of Positions: 3; Number of Levels: 1; Pitch: 0.197" (5.00mm); Plug Wire Entry: 180°; Wire Gauge or Range - AWG: 12-30 AWG; Wire Gauge or Range - mm²: 0.05-3mm²; Material Flammability Rating: UL94 V-0; Screw Size: M3; Torque - Screw: 0.79 Nm (7.0 Lb-In); Wire Strip Length: 6-7.5mm; Manufacturer Part Number 1: 796640-3; RoHS: RoHS Compliant; Stock 1: 7038; Pricing 1: 1=2.83, 10=2.144, 25=1.9872, 50=1.7866, 100=1.7431, 250=1.5252, 500=1.39446, 1000=1.26373, 5000=1.11121 (USD); Packaging: Bulk; Part Status: Active; Type: Plug, Female Sockets; Positions Per Level: 3; Header Orientation: -; Termination Style: Screw - Rising Cage Clamp; Mounting Type: Free Hanging (In-Line); Current - IEC: -; Color: Green; Operating Temperature: -40°C ~ 110°C; Contact Mating Finish: Tin; Features: Retention Latches (Non-Wire Side), Side Stacking; Ingress Protection: -; Contact Material: Phosphor Bronze; Housing Material: Polyamide (PA66), Nylon 6/6; Contact Tail Length: -; Insulation Height: 0.610" (15.49mm); ComponentLink1URL: http://www.te.com/commerce/DocumentDelivery/DDEController?Action=srchrtrv&DocNm=796640&DocType=Customer+Drawing&DocLang=English; ComponentLink1Description: http://www.te.com/commerce/DocumentDelivery/DDEController?Action=srchrtrv&DocNm=796640&DocType=Customer+Drawing&DocLang=English; Supplier 1: Digi-Key; Supplier Part Number 1: A98242-ND; Description 1: TERM BLOCK PLUG 3POS STR 5MM; Category: Connectors, Interconnects
TP3 = TP_25MILC: Test Point 25mil; .Checked PCB: CHK; .Checked SCH: CHK

## Sheet [10] - DOC REVISION HISTORY.SchDoc
size A3; DocumentNumber: 10; SheetNumber: 10; SheetTotal: 11
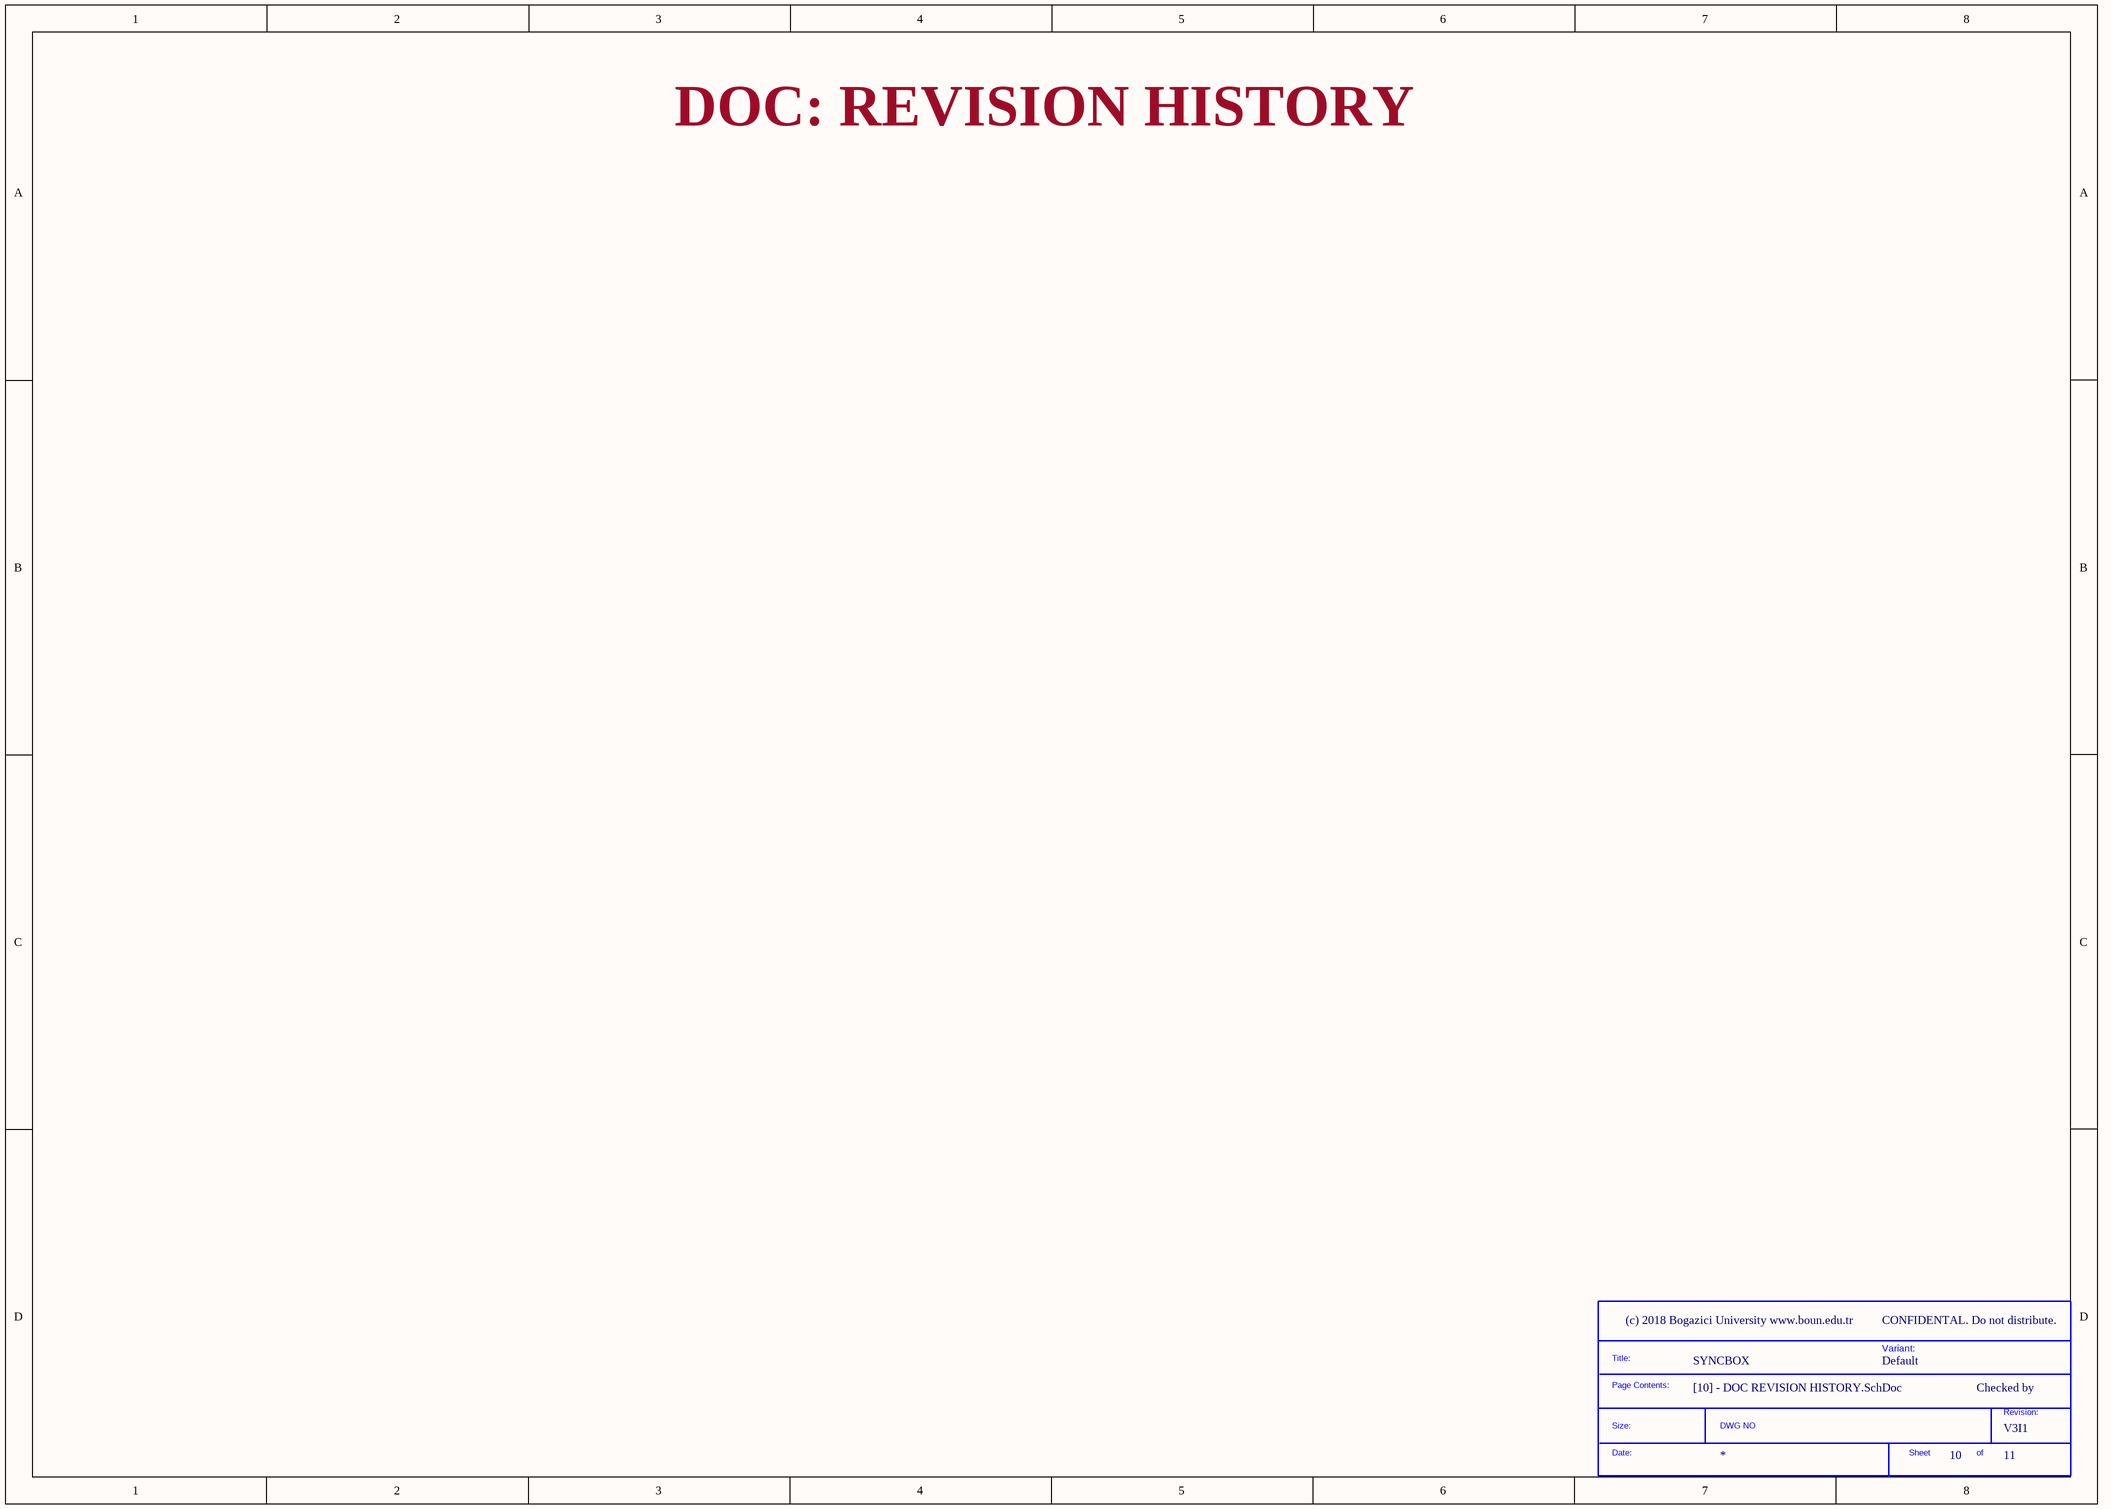
[diagram p15: [10] - DOC REVISION HISTORY.SchDoc]

### Parts
(Parts that share a designator on the sheet are numbered #1, #2 ... from top to bottom, then left to right.)
*#2  SDTitleBlock  (value not drawn)  (graphical)

### Notes on the sheet
- DOC: REVISION HISTORY
- CONFIDENTAL. Do not distribute.
- CLOCKS (CPU & PCIE)
- Variant:
- Checked by
- (in symbol SDTitleBlock) Title:; Page Contents:; Revision:; Size:; DWG NO; Date:; Sheet; of

## Nets that join several sheets
+5V: [05] - POWER (10 pins), [06] - MICRO CONTROLLER CONNECTORS (11 pins), [07] - CPU CONNECTORS  (6 pins), [08] - CPU USB (8 pins)
+VIN: [04] - COMe CONNECTOR (12 pins), [05] - POWER (9 pins), [06] - MICRO CONTROLLER CONNECTORS (P3.1 P3.2), [07] - CPU CONNECTORS  (J12.20 J12.21 J12.22)
GND: [03] - MICRO CONTROLLER (19 pins), [04] - COMe CONNECTOR (25 pins), [05] - POWER (50 pins), [06] - MICRO CONTROLLER CONNECTORS (64 pins), [07] - CPU CONNECTORS  (73 pins), [08] - CPU USB (35 pins), [09] - PCB AND MECHANICALS (TP3.1)
PWR_OUT2: [03] - MICRO CONTROLLER (13 pins), [05] - POWER (12 pins), [06] - MICRO CONTROLLER CONNECTORS (16 pins), [07] - CPU CONNECTORS  (42 pins)
BUZZER_CRTL: [03] - MICRO CONTROLLER (U1#1.78), [06] - MICRO CONTROLLER CONNECTORS (Q6.1 R37.2)
CPU_GPO0: [04] - COMe CONNECTOR (J8#1.A93), [07] - CPU CONNECTORS  (U8.2)
GPIO0: [03] - MICRO CONTROLLER (U1#1.6), [06] - MICRO CONTROLLER CONNECTORS (R24.1 U5.4)
GPIO1: [03] - MICRO CONTROLLER (U1#1.8), [06] - MICRO CONTROLLER CONNECTORS (R33.2 R68.1)
GPIO2: [03] - MICRO CONTROLLER (U1#1.7), [06] - MICRO CONTROLLER CONNECTORS (R21.1 R32.2)
GPIO3: [03] - MICRO CONTROLLER (U1#1.11), [06] - MICRO CONTROLLER CONNECTORS (R20.1 R35.2)
GPIO4: [03] - MICRO CONTROLLER (U1#1.12), [06] - MICRO CONTROLLER CONNECTORS (R19.1 R36.2)
GPIO5: [03] - MICRO CONTROLLER (U1#1.10), [06] - MICRO CONTROLLER CONNECTORS (D14.2 R13.1 U2.4)
GPIO6: [03] - MICRO CONTROLLER (U1#1.9), [06] - MICRO CONTROLLER CONNECTORS (D13.2 R65.1 U25.4)
MCU_CAN_INH: [03] - MICRO CONTROLLER (U1#1.99), [06] - MICRO CONTROLLER CONNECTORS (R2#2.2)
MCU_CAN_RX: [03] - MICRO CONTROLLER (U1#1.98), [06] - MICRO CONTROLLER CONNECTORS (U1#2.4)
MCU_CAN_TX: [03] - MICRO CONTROLLER (U1#1.100), [06] - MICRO CONTROLLER CONNECTORS (U1#2.1)
MCU_UART1_RX: [03] - MICRO CONTROLLER (U1#1.49), [06] - MICRO CONTROLLER CONNECTORS (U?#1.15)
MCU_UART1_TX: [03] - MICRO CONTROLLER (U1#1.50), [06] - MICRO CONTROLLER CONNECTORS (U?#1.13)
MCU_UART2_RX: [03] - MICRO CONTROLLER (U1#1.40), [06] - MICRO CONTROLLER CONNECTORS (U?#1.10)
MCU_UART2_TX: [03] - MICRO CONTROLLER (U1#1.39), [06] - MICRO CONTROLLER CONNECTORS (U?#1.12)
MCU_UART3_RX: [03] - MICRO CONTROLLER (U1#1.96), [06] - MICRO CONTROLLER CONNECTORS (U?#2.15)
MCU_UART3_TX: [03] - MICRO CONTROLLER (U1#1.97), [06] - MICRO CONTROLLER CONNECTORS (U?#2.13)
MCU_UART4_RX: [03] - MICRO CONTROLLER (U1#1.89), [06] - MICRO CONTROLLER CONNECTORS (J?#4.2 J?#6.1 J?#13.2 P?#2.1)
MCU_UART4_TX: [03] - MICRO CONTROLLER (U1#1.90), [06] - MICRO CONTROLLER CONNECTORS (J?#1.1 J?#5.1 J?#12.1 P?#2.3)
MCU_USB_D_N: [03] - MICRO CONTROLLER (U1#1.56), [06] - MICRO CONTROLLER CONNECTORS (L7.1)
MCU_USB_D_P: [03] - MICRO CONTROLLER (U1#1.57), [06] - MICRO CONTROLLER CONNECTORS (L7.2)
NetC3#2_2: [04] - COMe CONNECTOR (J8#1.B49), [05] - POWER (C3#2.2 R5#2.1)
NetC29_2: [04] - COMe CONNECTOR (J8#1.A14), [07] - CPU CONNECTORS  (C29.2)
NetC?#16_2: [04] - COMe CONNECTOR (J8#1.B81), [07] - CPU CONNECTORS  (C?#16.2)
NetC?#17_2: [04] - COMe CONNECTOR (J8#1.B82), [07] - CPU CONNECTORS  (C?#17.2)
NetC?#18_2: [04] - COMe CONNECTOR (J8#1.B71), [07] - CPU CONNECTORS  (C?#18.2)
NetC?#19_2: [04] - COMe CONNECTOR (J8#1.B72), [07] - CPU CONNECTORS  (C?#19.2)
NetC?#20_2: [04] - COMe CONNECTOR (J8#1.B73), [07] - CPU CONNECTORS  (C?#20.2)
NetC?#21_2: [04] - COMe CONNECTOR (J8#1.B74), [07] - CPU CONNECTORS  (C?#21.2)
NetC?#22_2: [04] - COMe CONNECTOR (J8#1.B75), [07] - CPU CONNECTORS  (C?#22.2)
NetC?#23_2: [04] - COMe CONNECTOR (J8#1.B76), [07] - CPU CONNECTORS  (C?#23.2)
NetJ8#1_A8: [04] - COMe CONNECTOR (J8#1.A8), [07] - CPU CONNECTORS  (J20.11)
NetJ8#1_A28: [04] - COMe CONNECTOR (J8#1.A28), [07] - CPU CONNECTORS  (U16.2)
NetJ8#1_A44: [04] - COMe CONNECTOR (J8#1.A44), [08] - CPU USB (U19.2 U19.3)
NetJ8#1_A63: [04] - COMe CONNECTOR (J8#1.A63), [07] - CPU CONNECTORS  (U8.7)
NetJ8#1_A67: [04] - COMe CONNECTOR (J8#1.A67), [07] - CPU CONNECTORS  (U8.5)
NetJ8#1_A85: [04] - COMe CONNECTOR (J8#1.A85), [07] - CPU CONNECTORS  (U8.3)
NetJ8#1_B2: [04] - COMe CONNECTOR (J8#1.B2), [07] - CPU CONNECTORS  (J20.9)
NetJ8#1_B12: [04] - COMe CONNECTOR (J8#1.B12), [05] - POWER (R3#2.2)
NetJ8#1_B24: [04] - COMe CONNECTOR (J8#1.B24), [05] - POWER (Q5.1 R75.2)
NetJ8#1_B44: [04] - COMe CONNECTOR (J8#1.B44), [08] - CPU USB (U28.8)
NetJ8#1_B54: [04] - COMe CONNECTOR (J8#1.B54), [07] - CPU CONNECTORS  (U8.4)
NetJ8#1_B57: [04] - COMe CONNECTOR (J8#1.B57), [07] - CPU CONNECTORS  (U8.6)
NetJ8#1_B63: [04] - COMe CONNECTOR (J8#1.B63), [07] - CPU CONNECTORS  (U8.8)
NetJ8#1_B89: [04] - COMe CONNECTOR (J8#1.B89), [07] - CPU CONNECTORS  (U17.7)
NetJ8#1_B95: [04] - COMe CONNECTOR (J8#1.B95), [07] - CPU CONNECTORS  (R34.2)
NetJ8#1_B98: [04] - COMe CONNECTOR (J8#1.B98), [07] - CPU CONNECTORS  (R60.1 U17.9)
NetJ8#1_B99: [04] - COMe CONNECTOR (J8#1.B99), [07] - CPU CONNECTORS  (R61.1 U17.8)
NetJ?#1_2: [06] - MICRO CONTROLLER CONNECTORS (J?#1.2 J?#7.2 P?#1.1), [07] - CPU CONNECTORS  (U14.15)
NetJ?#4_1: [06] - MICRO CONTROLLER CONNECTORS (J?#4.1 J?#10.1 P?#1.3), [07] - CPU CONNECTORS  (U14.13)
SATA_CON_RX_N: [04] - COMe CONNECTOR (J8#1.A20), [07] - CPU CONNECTORS  (J12.5)
SATA_CON_RX_P: [04] - COMe CONNECTOR (J8#1.A19), [07] - CPU CONNECTORS  (J12.6)
SATA_CON_TX_N: [04] - COMe CONNECTOR (J8#1.A17), [07] - CPU CONNECTORS  (J12.3)
SATA_CON_TX_P: [04] - COMe CONNECTOR (J8#1.A16), [07] - CPU CONNECTORS  (J12.2)
SSRX0_N: [04] - COMe CONNECTOR (J8#1.A22), [08] - CPU USB (L10.1)
SSRX0_P: [04] - COMe CONNECTOR (J8#1.A23), [08] - CPU USB (L10.2)
SSRX1_N: [04] - COMe CONNECTOR (J8#1.A25), [08] - CPU USB (L4.2)
SSRX1_P: [04] - COMe CONNECTOR (J8#1.A26), [08] - CPU USB (L4.1)
SSTX0_N: [04] - COMe CONNECTOR (J8#1.B22), [08] - CPU USB (L8.1)
SSTX0_P: [04] - COMe CONNECTOR (J8#1.B23), [08] - CPU USB (L8.2)
SSTX1_N: [04] - COMe CONNECTOR (J8#1.B25), [08] - CPU USB (L5.2)
SSTX1_P: [04] - COMe CONNECTOR (J8#1.B26), [08] - CPU USB (L5.1)
TRD0_N: [04] - COMe CONNECTOR (J8#1.A12), [07] - CPU CONNECTORS  (T1.12)
TRD0_P: [04] - COMe CONNECTOR (J8#1.A13), [07] - CPU CONNECTORS  (T1.11)
TRD1_N: [04] - COMe CONNECTOR (J8#1.A9), [07] - CPU CONNECTORS  (T1.6)
TRD1_P: [04] - COMe CONNECTOR (J8#1.A10), [07] - CPU CONNECTORS  (T1.5)
TRD2_N: [04] - COMe CONNECTOR (J8#1.A6), [07] - CPU CONNECTORS  (T1.9)
TRD2_P: [04] - COMe CONNECTOR (J8#1.A7), [07] - CPU CONNECTORS  (T1.8)
TRD3_N: [04] - COMe CONNECTOR (J8#1.A2), [07] - CPU CONNECTORS  (T1.3)
TRD3_P: [04] - COMe CONNECTOR (J8#1.A3), [07] - CPU CONNECTORS  (T1.2)
USB0_N: [04] - COMe CONNECTOR (J8#1.A45 J8#1.B45), [08] - CPU USB (L6.1 L9.2)
USB0_P: [04] - COMe CONNECTOR (J8#1.A46 J8#1.B46), [08] - CPU USB (L6.2 L9.1)
USB2_N: [04] - COMe CONNECTOR (J8#1.A42), [08] - CPU USB (L11.2)
USB2_P: [04] - COMe CONNECTOR (J8#1.A43), [08] - CPU USB (L11.1)
USB3_N: [04] - COMe CONNECTOR (J8#1.B42), [08] - CPU USB (L12.1)
USB3_P: [04] - COMe CONNECTOR (J8#1.B43), [08] - CPU USB (L12.2)
VBUS: [03] - MICRO CONTROLLER (C6#1.2 U1#1.54), [06] - MICRO CONTROLLER CONNECTORS (D27.1)